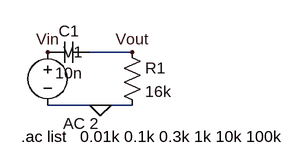
[diagram p0: schematic High pass filter.asc]
High pass filter.asc, the LTspice schematic file:
Version 4
SHEET 1 880 680
WIRE 336 128 272 128
WIRE 288 208 208 208
WIRE 336 208 288 208
FLAG 288 208 0
FLAG 336 128 Vout
FLAG 208 128 Vin
SYMBOL res 320 112 R0
SYMATTR InstName R1
SYMATTR Value 16k
SYMBOL cap 272 112 R90
WINDOW 0 0 32 VBottom 2
WINDOW 3 32 32 VTop 2
SYMATTR InstName C1
SYMATTR Value 10n
SYMBOL voltage 208 112 R0
WINDOW 123 24 124 Left 2
WINDOW 39 0 0 Left 0
SYMATTR InstName V1
SYMATTR Value ""
SYMATTR Value2 AC 2
TEXT 168 256 Left 2 !.ac list   0.01k 0.1k 0.3k 1k 10k 100k

The netlist it stands for:
* High pass filter.asc
R1 Vout 0 16k
C1 Vout Vin 10n
V1 Vin 0 AC 2
.ac list   0.01k 0.1k 0.3k 1k 10k 100k
.backanno
.end